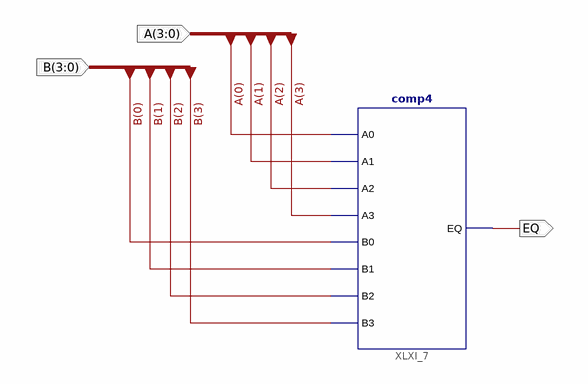
[diagram p0: schematic sheet 1]
// Xilinx ISE schematic comp2x4.sch (spartan6) as structural Verilog: 1 symbols, 3 ports
module comp2x4 (
  input  [3:0] B,
  input  [3:0] A,
  output EQ
);

  comp4 XLXI_7 (.A0(A[0]), .A1(A[1]), .A2(A[2]), .A3(A[3]), .B0(B[0]), .B1(B[1]), .B2(B[2]), .B3(B[3]), .EQ(EQ));
endmodule
